# EAGLE design TFTBackpack (EAGLE 7.6.0)
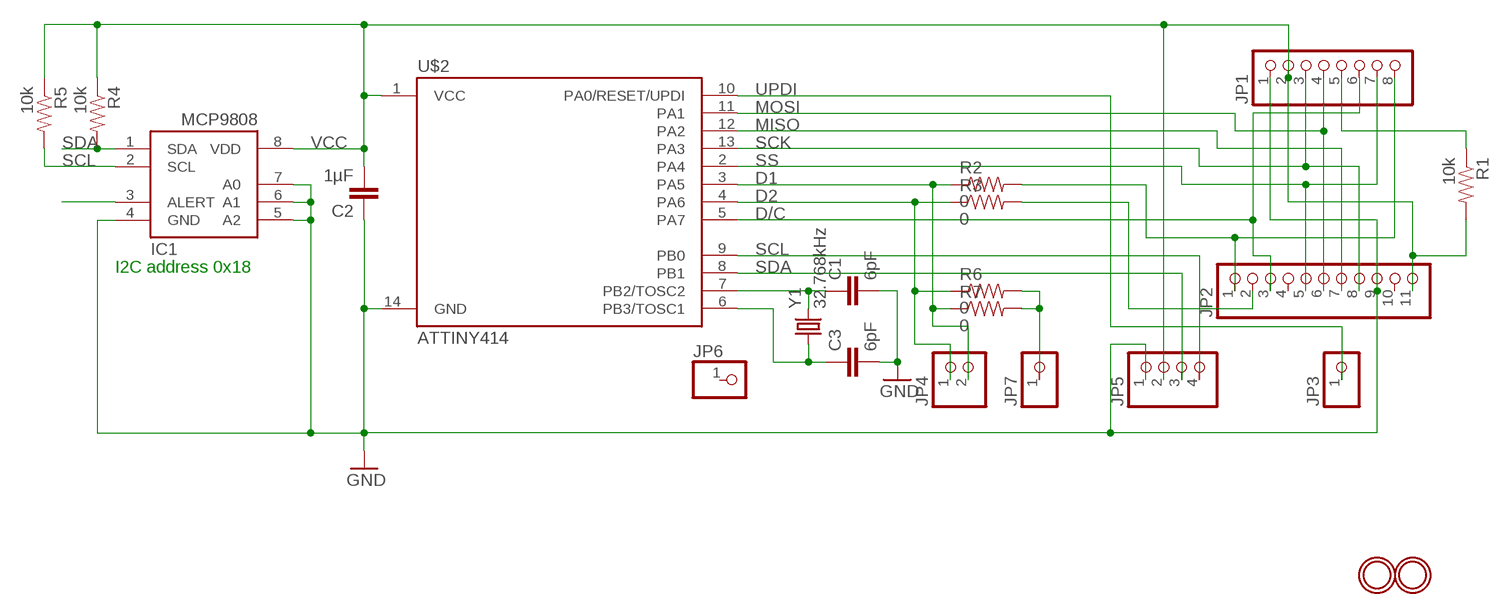
[diagram p0: schematic, sheet 1]

## Parts
C1  6pF  CAP0805  [0805]
C2  1µF  CAP0805  [0805]
C3  6pF  CAP0805  [0805]
IC1  MCP9808-E/MS  [MSOP8_0.65MM]
JP1  HEADER-1X8ROUND  [1X08_ROUND]
JP2  HEADER-1X11  [1X11_ROUND]
JP3  HEADER-1X1ROUND  [1X01_ROUND]
JP4  HEADER-1X2ROUND  [1X02_ROUND]
JP5  HEADER-1X4ROUND  [1X04_ROUND]
JP6  HEADER-1X1ROUND  [1X01_ROUND]
JP7  HEADER-1X1ROUND  [1X01_ROUND]
R1  10k  0.3OHM-1/8W-1%(0805)  [0805]
R2  0  0.3OHM-1/8W-1%(0805)  [0805]
R3  0  0.3OHM-1/8W-1%(0805)  [0805]
R4  10k  0.3OHM-1/8W-1%(0805)  [0805]
R5  10k  0.3OHM-1/8W-1%(0805)  [0805]
R6  0  0.3OHM-1/8W-1%(0805)  [0805]
R7  0  0.3OHM-1/8W-1%(0805)  [0805]
U$1  MOUNTINGHOLE2.5  [MOUNTINGHOLE_2.5_PLATED]
U$2  ATTINY414  [SO14]
U$9  MOUNTINGHOLE2.5  [MOUNTINGHOLE_2.5_PLATED]
Y1  32.768kHz  CRYSTAL3.2X1.5MM  [CRYSTAL-SMD-3.2X1.5MM]

## Nets
ALERT: IC1.3(ALERT)
BL: JP1.8 JP2.1 R2.2
D1: JP4.2 R2.1 R7.1 U$2.3(PA5)
D2: JP4.1 R3.1 R6.1 U$2.4(PA6)
D/C: JP1.6 JP2.3 U$2.5(PA7)
GND: C1.2 C2.1 C3.2 IC1.4(GND) IC1.5(A2) IC1.6(A1) IC1.7(A0) JP1.1 JP2.9 JP5.1 U$2.14(GND)
MISO: JP2.7 U$2.12(PA2)
MOSI: JP1.4 JP2.6 U$2.11(PA1)
N$1: JP7.1 R6.2 R7.2
N$2: C1.1 U$2.7(PB2/TOSC2) Y1.P$2
N$3: C3.1 U$2.6(PB3/TOSC1) Y1.P$1
N$4: JP1.5 R1.1
N$5: JP2.2 R3.2
SCK: JP1.3 JP2.8 U$2.13(PA3)
SCL: IC1.2(SCL) JP5.4 R5.2 U$2.9(PB0)
SDA: IC1.1(SDA) JP5.3 R4.2 U$2.8(PB1)
SS: JP1.7 JP2.5 U$2.2(PA4)
UPDI: JP3.1 U$2.10(PA0/RESET/UPDI)
VCC: C2.2 IC1.8(VDD) JP1.2 JP2.11 JP5.2 R1.2 R4.1 R5.1 U$2.1(VCC)
Unconnected: JP2.4 JP2.10 JP6.1

## Notes on the sheet
- I2C address 0x18

## Library data of the parts
C1-C3 = SparkFun-Capacitors:CAP: Capacitor Standard 0603 ceramic capacitor, and 0.1" leaded capacitor.
IC1 = microbuilder:MCP9808
JP1 = technoblogy:HEADER-1X8: PIN HEADER
JP2 = technoblogy:HEADER-1X11
JP3 JP6 JP7 = microbuilder:HEADER-1X1: PIN HEADER
JP4 = microbuilder:HEADER-1X2: PIN HEADER
JP5 = microbuilder:HEADER-1X4: PIN HEADER
R1-R7 = SparkFun-Resistors:0.3OHM-1/8W-1%(0805): RES-11622; PROD_ID: RES-11622; VALUE: 0.3
U$1 U$9 = microbuilder:MOUNTINGHOLE: Mounting Hole For #2 screws (0.086"/2.18mm width, 0.094"/2.4mm hole) use 2.5mm; BOM: EXCLUDE
U$2 = technoblogy:ATTINY414: Atmel 14-pin 2/4/8kB flash uC; PROD_ID: IC-11285
Y1 = SparkFun-FreqCtrl:CRYSTAL: Various standard crystals. Proven footprints.; PROD_ID: XTAL-13062

## Net classes
1 power: width 0.305 mm

## Board
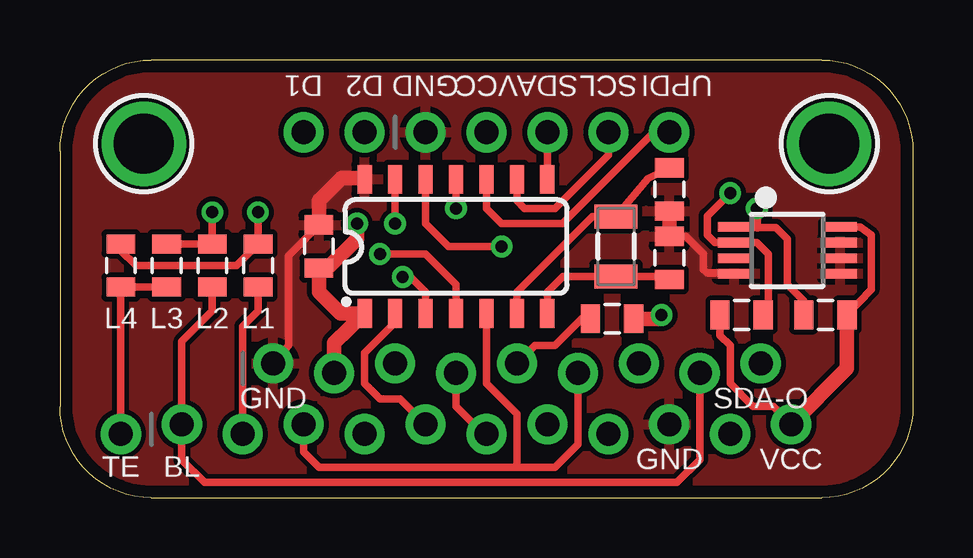
[diagram p1: board, top side]
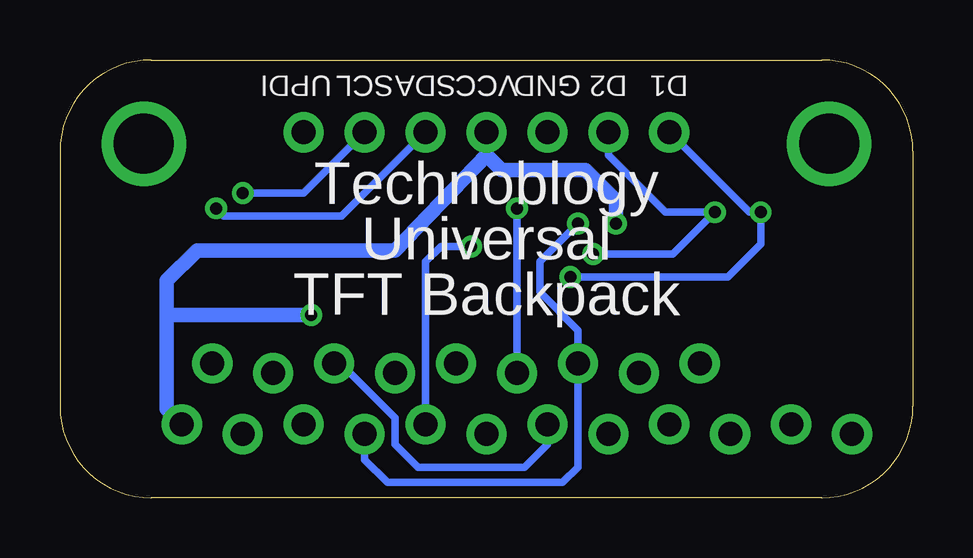
[diagram p2: board, bottom side, seen from below]

Size 35.56 x 18.26 mm. Coordinates in mm from the lower left corner, seen from the top.
Outline: 0,14.45 arc-90 3.81,18.26 31.75,18.26 arc-90 35.56,14.45 35.56,3.81 arc-90 31.75,0 3.81,0 arc-90 0,3.81 0,14.45
Copper layers (1*16): Top 0.035mm / dielectric 1.5mm / Bottom 0.035mm
Design rules "default *": minimum track width 10mil, minimum drill 24mil, track to track 8mil, track to pad 8mil, pad to pad 8mil, via to via 8mil, smd to smd 8mil, copper to edge 20mil, drill to drill 8mil, minimum pad ring 10mil, minimum via ring 8mil, stop-mask expansion 4mil, vias tented up to drill 20mil, thermal gap 10mil

### Footprints (pad centres in the part's own frame; a part is rotated, then mirrored left to right if it is on the bottom)
0805 = smd 0.8 x 1.2: 1 -0.9,0; 2 0.9,0
MSOP8_0.65MM = smd 0.4 x 1.4: 1 -0.975,-2.2; 2 -0.325,-2.2; 3 0.325,-2.2; 4 0.975,-2.2; 5 0.975,2.2; 6 0.325,2.2; 7 -0.325,2.2; 8 -0.975,2.2
1X08_ROUND = drill 1 pad 1.676: 1 -8.89,0.203; 2 -6.35,-0.203; 3 -3.81,0.203; 4 -1.27,-0.203; 5 1.27,0.203; 6 3.81,-0.203; 7 6.35,0.203; 8 8.89,-0.203
1X11_ROUND = drill 1 pad 1.676: 1 -12.7,0.203; 2 -10.16,-0.203; 3 -7.62,0.203; 4 -5.08,-0.203; 5 -2.54,0.203; 6 0,-0.203; 7 2.54,0.203; 8 5.08,-0.203; 9 7.62,0.203; 10 10.16,-0.203; 11 12.7,0.203
1X01_ROUND = drill 1 pad 1.676: 1 0,0
1X02_ROUND = drill 1 pad 1.676: 1 -1.27,0; 2 1.27,0
1X04_ROUND = drill 1 pad 1.676: 1 -3.81,0; 2 -1.27,0; 3 1.27,0; 4 3.81,0
MOUNTINGHOLE_2.5_PLATED = drill 2.5 pad 3.2: P$1 0,0
SO14 = smd 0.6 x 1.2: 1 -3.81,-2.8; 2 -2.54,-2.8; 3 -1.27,-2.8; 4 0,-2.8; 5 1.27,-2.8; 6 2.54,-2.8; 7 3.81,-2.8; 8 3.81,2.8; 9 2.54,2.8; 10 1.27,2.8; 11 0,2.8; 12 -1.27,2.8; 13 -2.54,2.8; 14 -3.81,2.8
CRYSTAL-SMD-3.2X1.5MM = smd 1 x 1.8: P$1 -1.25,0; P$2 1.25,0

### Placement (x,y rotation side)
C1  25.4,10 90 top
C2  10.8,10.48 270 top
C3  25.4,12.86 270 top
IC1  30.32,10.32 270 top
JP1  17.78,5.4 0 top
JP2  17.78,2.86 0 top
JP3  25.4,15.24 0 top
JP4  11.43,15.24 180 top
JP5  19.05,15.24 0 top
JP6  29.21,5.6 0 top
JP7  2.54,2.65 0 top
R1  23.02,7.46 0 top
R2  6.35,9.68 270 top
R3  8.25,9.68 270 top
R4  31.91,7.62 180 top
R5  28.42,7.62 0 top
R6  2.54,9.68 270 top
R7  4.45,9.68 270 top
U$1  3.49,14.76 0 top
U$2  16.51,10.48 0 top
U$9  32.07,14.76 0 top
Y1  23.18,10.48 270 top

### Tracks (layer width: path | path; a pad name or v marks a point on that pad's centre or on a via)
BL
  Top 0.305: JP1.8 26.67,1.59 25.72,0.64 6.03,0.64 5.08,1.59 JP2.1 5.08,6.51 6.35,7.78 R2.2
D1  (via drill 0.5)
  Top 0.305: v6.35,11.91 R2.1 R7.1 | v14.29,9.21 14.61,9.21 15.24,8.57 U$2.3
  Bottom 0.305: v14.29,9.21 7.73,9.21 R2.1 v6.35,11.91 6.83,11.91 JP4.2
D2  (via drill 0.5)
  Top 0.305: 16.51,7.3 U$2.4 16.51,8.89 15.24,10.16 v13.34,10.16 | v8.25,11.91 R3.1 7.35,9.68 3.17,9.68 2.54,10.32 R6.1
  Bottom 0.305: v13.34,10.16 10,10.16 v8.25,11.91 10.32,11.91 12.7,14.29 JP4.1
D/C
  Top 0.305: 19.05,1.27 20.64,1.27 21.59,2.22 JP1.6 21.59,5.4 | 19.05,1.27 10.8,1.27 10.16,1.91 JP2.3 | 19.05,1.27 19.05,3.49 17.78,4.76 U$2.5
GND
  Top 0.305: JP1.1 9.52,6.35 9.52,10.11 C2.1 | C1.2 26.09,10.9 26.83,10.16 26.83,9.53 26.99,9.37 28.1,9.37 IC1.4
  Top 0.61: C3.2 C1.2 | C2.1 10.8,12.38 11.75,13.34 12.64,13.34 U$2.14
  pour Top: 0,18.26 35.56,18.26 35.56,0 0,0
MISO  (via drill 0.5)
  Top 0.305: U$2.12 15.24,11.43 16.19,10.48 v18.41,10.48
  Bottom 0.305: JP2.7 20.32,9.84 19.69,10.48 v18.41,10.48
MOSI  (via drill 0.5)
  Top 0.305: JP2.6 17.67,2.65 16.51,3.81 JP1.4 | U$2.11 v16.51,12.06
  Bottom 0.305: JP1.4 v16.51,12.06
N$1
  Top 0.305: R7.2 R6.2 JP7.1
N$2
  Top 0.305: U$2.7 20.32,8.57 20.98,9.23 Y1.P$2 25.4,9.23 C1.1
N$3
  Top 0.305: U$2.6 19.05,8.57 22.21,11.73 Y1.P$1 24.5,13.31 C3.1
N$4
  Top 0.305: R1.1 21.91,7.62 20.64,6.35 19.8,6.35 JP1.5
N$5
  Top 0.305: 7.73,2.65 JP2.2 7.62,7.14 8.25,7.78 R3.2
SCK  (via drill 0.5)
  Top 0.305: 13.97,13.65 U$2.13 v13.97,11.43
  Bottom 0.305: JP2.8 22.86,1.59 21.91,0.64 14.61,0.64 13.97,1.27 JP1.3 13.97,6.99 15.56,8.57 15.56,9.84 v13.97,11.43
SCL  (via drill 0.5)
  Top 0.305: U$2.9 19.05,12.38 19.37,12.06 20.64,12.06 22.86,14.29 JP5.4 | R5.2 29.53,7.83 29.53,10.16 29.04,10.64 IC1.2 27.3,10.64 26.99,10.95 26.99,11.75 v27.94,12.7
  Bottom 0.305: v27.94,12.7 25.4,12.7 JP5.4
SDA  (via drill 0.5)
  Top 0.305: U$2.8 JP5.3 | R4.2 31.01,8.2 30.32,8.89 30.32,10.79 29.84,11.27 28.14,11.27 IC1.1 29.07,11.25 v29.05,12.06
  Bottom 0.305: JP5.3 23.81,11.75 28.73,11.75 v29.05,12.06
SS
  Top 0.305: U$2.2 13.97,7.3 12.7,6.03 12.7,4.76 13.34,4.13 14.17,4.13 JP2.5
  Bottom 0.305: JP2.5 15.24,2.22 16.19,1.27 20.64,1.27 21.59,2.22 21.59,3.33 23.86,5.6 JP1.7
UPDI
  Top 0.305: U$2.10 17.78,12.06 18.41,11.43 20.96,11.43 24.77,15.24 JP3.1
VCC  (via drill 0.5)
  Top 0.305: C2.2 11.16,9.58 | IC1.8 33.36,11.29 33.81,10.95 33.81,8.68 R4.1 | R5.1 27.52,6.77 27.94,6.35 27.94,4.76 28.89,3.81 29.73,3.81 JP2.11
  Top 0.61: JP1.2 11.43,6.46 U$2.1 11.69,7.68 10.8,8.57 C2.2 | 11.16,9.58 12.38,10.79 v12.38,11.43 | R4.1 32.81,5.39 JP2.11 | R1.2 25.08,7.46 v25.08,7.62
  Bottom 0.61: v25.08,7.62 31.12,7.62 | JP5.2 17.78,14.29 | 17.78,14.29 21.59,10.32 29.84,10.32 31.12,9.05 31.12,7.62 | v12.38,11.43 12.38,12.38 13.65,13.65 17.14,13.65 17.78,14.29 | 31.12,7.62 31.12,3.7 JP2.11

### Text on the board
tPlace: D1 | D2 | GND | VCC | SDA | SCL | UPDI | L4 | L3 | L2 | L1 | GND | SDA-O | GND | VCC | TE | BL
bPlace: D1 | D2 | GND | VCC | SDA | SCL | UPDI | Technoblogy / Universal / TFT Backpack